# EasyEDA Pro project STM32F103ZET6__SS_.epro, board PCB1
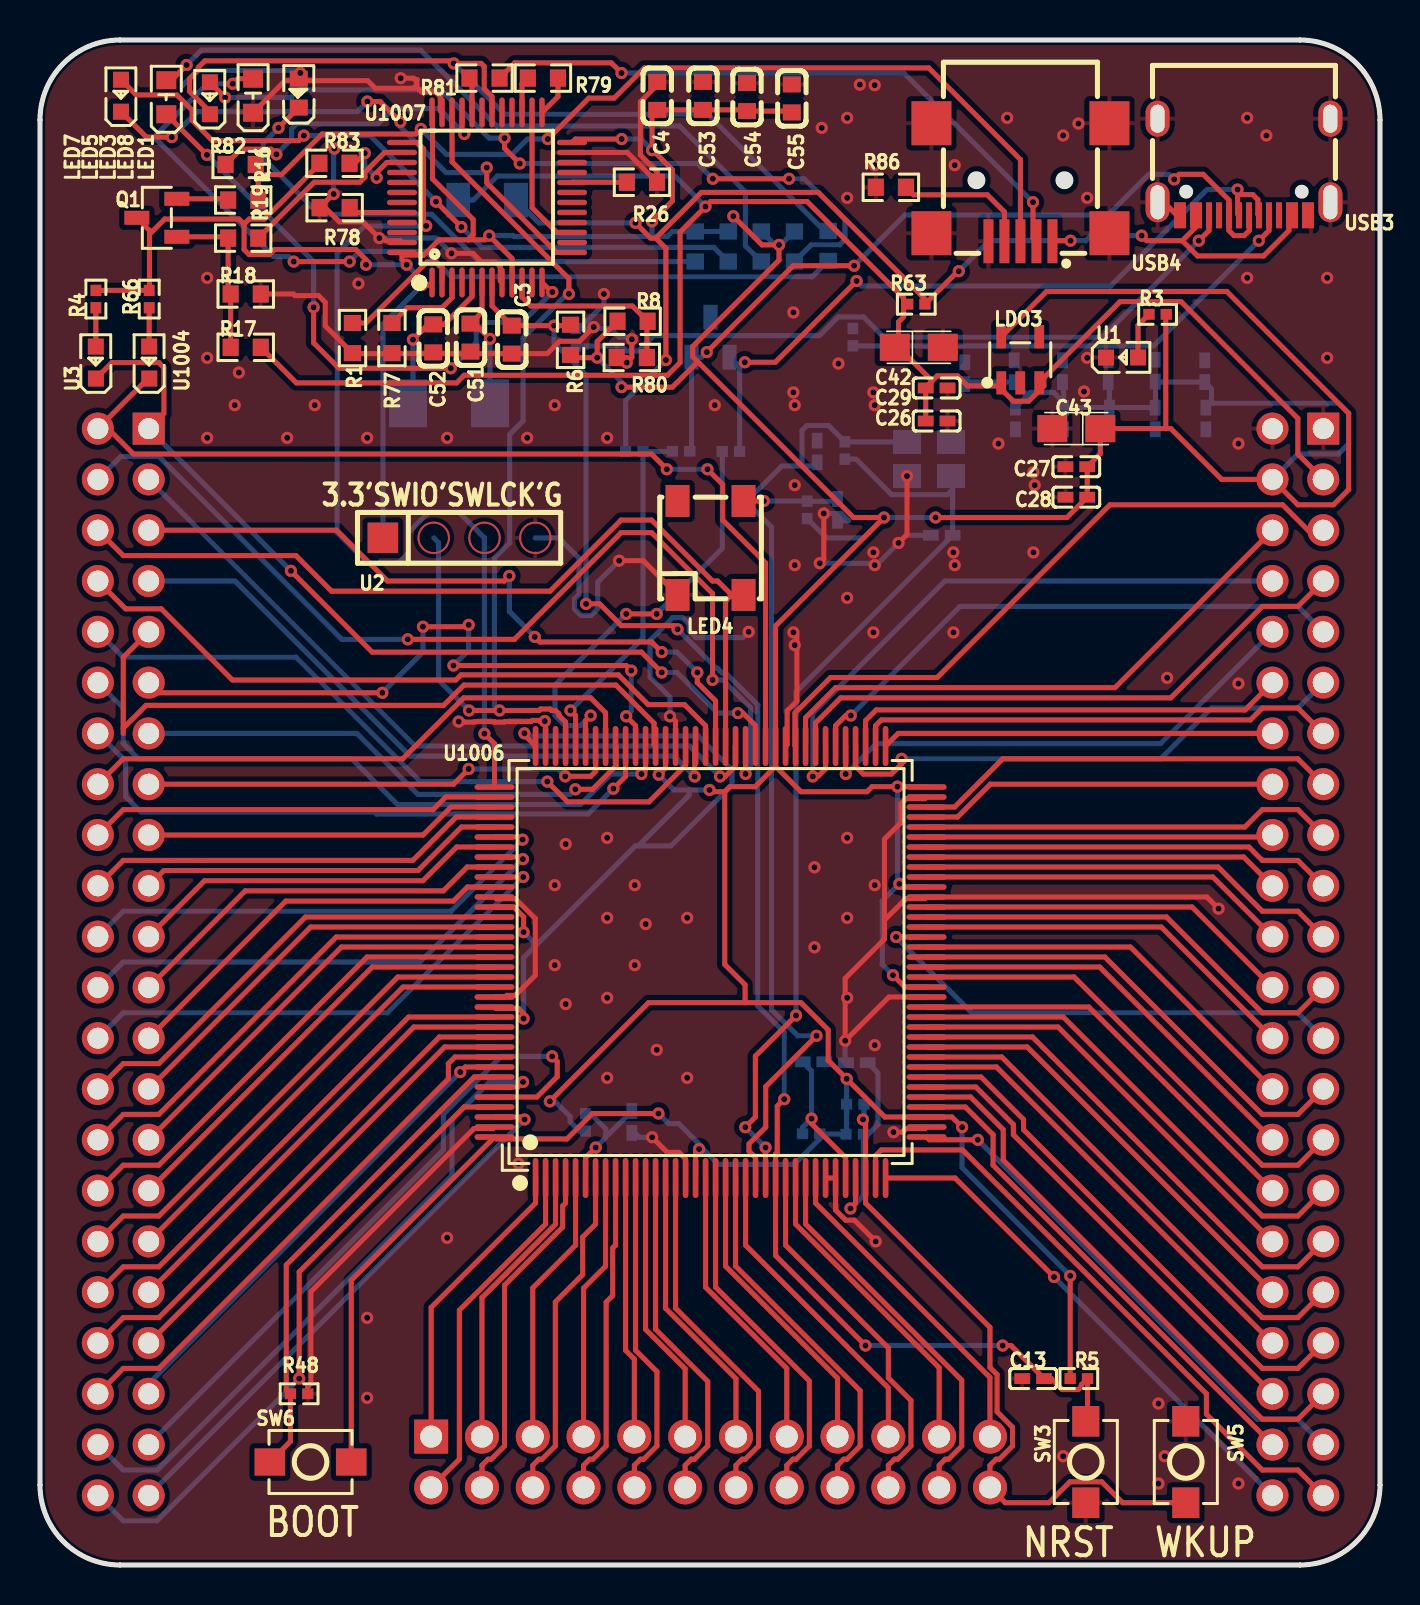
[diagram p1: board, top side]
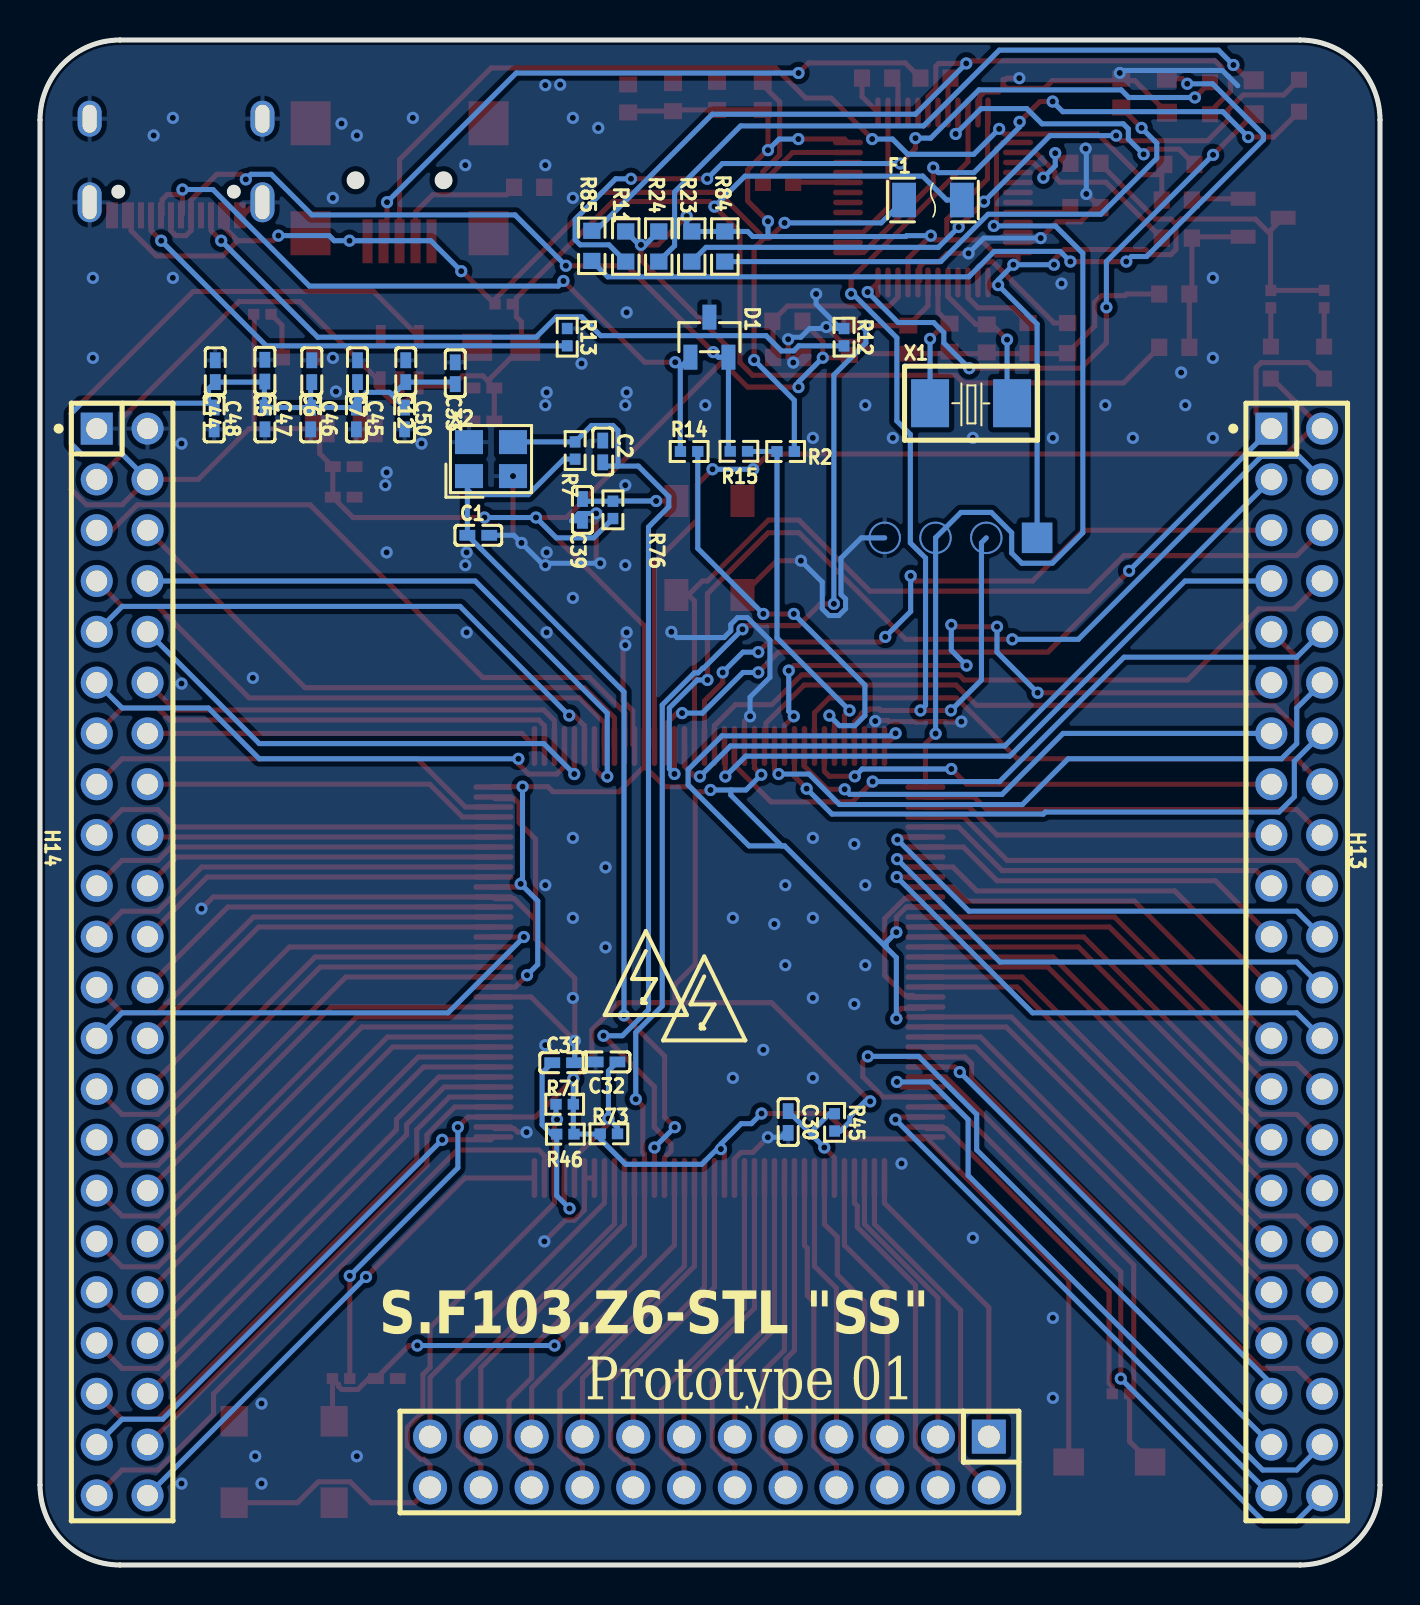
[diagram p2: board, bottom side, seen from below]

Outline 67 x 76.25 mm; copper layers: Top Layer, Bottom Layer. Coordinates in mm from the lower left corner of the outline.
Outline path: 0,72.25 0,4 arc(1.17,1.17) 4,0 63,0 arc(65.83,1.17) 67,4 67,72.25 arc(65.83,75.08) 63,76.25 4,76.25 arc(1.17,75.08) 0,72.25
Stack: Top Layer 0.035mm / Dielectric1 1.51mm FR4 er 4.5 / Bottom Layer 0.035mm

## Design rules (mm)
template: JLCPCB Capability(Two Layers Board)
spacing copperThickness1oz (default): track to track 0.102, other pairs 0.152 to 0.3
spacing copperThickness2oz: track to track 0.203, other pairs 0.152 to 0.3
track width copperThickness1oz (default): min 0.127, default 0.254, max 2.54
track width copperThickness2oz: min 0.203, default 0.254, max 2.54
differential pair differentialPair (default): width min 0.127, default 0.254, max 2.54; gap min 0.152, default 0.152
via viaSize (default): diameter min 0.5, default 0.61, max 10; hole min 0.3, default 0.305, max 6.3

## Placement (name value [footprint] x y rotation side)
C1  22pF  [C0402]  45.08 51.49 180 bottom
C2  22pF  [C0402]  38.86 55.68 270 bottom
C3  100nF  [C0603]  23.59 61.27 270 top
C4  100nF  [C0603]  30.86 73.46 90 top
C5  100nF  [C0402]  55.76 59.72 90 bottom
C6  100nF  [C0402]  53.41 59.69 90 bottom
C7  100nF  [C0402]  51.13 59.69 90 bottom
C12  100nF  [C0402]  48.71 59.69 90 bottom
C13  100nF  [C0402]  49.66 9.32 180 top
C26  100nF  [C0402]  44.83 57.2 0 top
C27  100nF  [C0402]  51.82 54.92 180 top
C28  100nF  [C0402]  51.82 53.39 180 top
C29  100nF  [C0402]  44.83 58.85 0 top
C30  100nF  [C0402]  29.59 22.15 270 bottom
C31  100nF  [C0402]  40.84 25.12 180 bottom
C32  100nF  [C0402]  38.67 25.15 0 bottom
C33  100nF  [C0402]  46.24 59.59 90 bottom
C39  100nF  [C0402]  39.88 52.76 270 bottom
C42  22uF  [CASE-A_3216]  43.94 60.88 0 top
C43  22uF  [CASE-A_3216]  51.82 56.82 180 top
C44  100nF  [C0402]  58.24 59.69 90 bottom
C45  100nF  [C0402]  51.18 57.33 270 bottom
C46  100nF  [C0402]  53.47 57.33 270 bottom
C47  100nF  [C0402]  55.75 57.33 270 bottom
C48  100nF  [C0402]  58.29 57.33 270 bottom
C50  100nF  [C0402]  48.77 57.33 270 bottom
C51  22pF  [C0603]  21.52 61.37 90 top
C52  22pF  [C0603]  19.66 61.33 90 top
C53  100nF  [C0603]  33.15 73.46 90 top
C54  100nF  [C0603]  35.35 73.4 90 top
C55  100nF  [C0603]  37.59 73.33 90 top
D1  ESD5302F-3/TR  [SOT-23-3_L2.9-W1.3-P1.90-LS2.4-BR]  33.53 61.39 270 bottom
F1  TLC-NSMD100  [F1206]  22.35 68.25 180 bottom
H12  PZ254V-12-24P  [HDR-TH_24P-P2.54-V-M-R2-C12-S2.54]  33.53 5.15 0 bottom
H13  X6521WV-2x22H-C60D30  [HDR-TH_44P-2.54-V-M-R2-C22-S2.54]  4.16 30.15 270 bottom
H14  X6521WV-2x22H-C60D30  [HDR-TH_44P-2.54-V-M-R2-C22-S2.54]  62.89 30.15 270 bottom
LDO3  ME6211C33M5G-N  [SOT-23-5_L3.0-W1.7-P0.95-LS2.8-BL]  49.01 60.26 0 top
LED1  19-217/BHC-ZL1M2RY/3T  [LED0603-FD_BLUE]  12.94 73.59 90 top
LED3  KT-0603R  [LED0603-RD]  8.5 73.34 90 top
LED4  WS2812E-V5  [LED-SMD_4P-L5.0-W5.0-LS5.4-TL-1]  33.53 50.85 270 top
LED5  NCD0603G1  [LED0603-RD_1]  6.31 73.39 90 top
LED7  KT-0603R  [LED0603-RD]  4.05 73.47 90 top
LED8  NCD0603G1  [LED0603-RD_1]  10.65 73.47 90 top
Q1  M8050  [SOT-23-3_L2.9-W1.3-P1.90-LS2.4-BR]  5.84 67.36 0 top
R1  10kΩ  [R0603]  15.62 61.35 90 top
R2  10kΩ  [R0402]  29.72 55.68 0 bottom
R3  10kΩ  [R0402]  55.88 62.54 0 top
R4  10kΩ  [R0402]  2.79 63.3 90 top
R5  10kΩ  [R0402]  51.94 9.32 180 top
R6  100kΩ  [R0603]  26.53 61.26 270 top
R7  10kΩ  [R0402]  40.24 55.73 90 bottom
R8  4.7kΩ  [R0603]  29.59 60.38 0 top
R11  1kΩ  [R0603]  37.71 65.93 270 bottom
R12  10kΩ  [R0402]  26.8 61.39 90 bottom
R13  10kΩ  [R0402]  40.64 61.39 90 bottom
R14  10kΩ  [R0402]  34.54 55.68 180 bottom
R15  10kΩ  [R0402]  32.05 55.68 180 bottom
R16  1.5kΩ  [R0603]  10.16 68.25 180 top
R17  10kΩ  [R0603]  10.29 60.88 0 top
R18  36kΩ  [R0603]  10.29 63.55 180 top
R19  100Ω  [R0603]  10.16 66.34 180 top
R23  1kΩ  [R0603]  34.41 65.93 270 bottom
R24  1kΩ  [R0603]  36.06 65.93 270 bottom
R26  10kΩ  [R0603]  30.1 69.14 180 top
R45  10kΩ  [R0402]  27.27 22.13 270 bottom
R46  10kΩ  [R0402]  40.73 21.54 0 bottom
R48  10kΩ  [R0402]  12.95 8.56 180 top
R63  10kΩ  [R0402]  43.82 63.04 0 top
R66  10kΩ  [R0402]  5.46 63.3 90 top
R71  10kΩ  [R0402]  40.77 23.04 180 bottom
R73  10kΩ  [R0402]  38.56 21.56 180 bottom
R76  10kΩ  [R0402]  38.35 52.76 90 bottom
R77  10kΩ  [R0603]  17.6 61.35 90 top
R78  10kΩ  [R0603]  14.73 67.87 180 top
R79  100Ω  [R0603]  25.15 74.35 0 top
R80  4.7kΩ  [R0603]  29.63 62.19 180 top
R81  10Ω  [R0603]  22.23 74.35 180 top
R82  10Ω  [R0603]  10.03 70.03 180 top
R83  4.7kΩ  [R0603]  14.72 70.09 0 top
R84  1kΩ  [R0603]  32.76 65.93 270 bottom
R85  1kΩ  [R0603]  39.41 65.96 270 bottom
R86  100kΩ  [R0603]  42.55 68.89 0 top
SW3  TS342A2P-WZ  [SW-SMD_L4.0-W2.9-LS5.0]  52.29 5.15 90 top
SW5  TS342A2P-WZ  [SW-SMD_L4.0-W2.9-LS5.0]  57.29 5.15 270 top
SW6  TS342A2P-WZ  [SW-SMD_L4.0-W2.9-LS5.0]  13.53 5.15 0 top
U1  -  [LED0603-RD_GREEN]  54.1 60.38 0 top
U2  -  [HDR4P]  15.88 50.09 0 top
U3  -  [LED0603-RD_GREEN]  2.79 60.12 90 top
U1004  -  [LED0603-RD_GREEN]  5.46 60.12 90 top
U1006  STM32F103ZET6  [LQFP-144_L20.0-W20.0-P0.50-LS22.0-BL]  33.53 30.15 0 top
U1007  STM32F103CBT6  [LQFP-48_L7.0-W7.0-P0.50-LS9.0-BL]  22.35 68.38 0 top
USB3  KH-TYPE-C-16P  [USB-C-SMD_KH-TYPE-C-16P]  60.2 69.9 180 top
USB4  MINI 5PTP  [MINI-USB-SMD_MINI-5PTP]  49.02 69.14 180 top
X1  8MHz  [OSC-SMD_L5.0-W3.2]  20.45 58.09 180 bottom
X2  8MHz  [CRYSTAL-SMD_4P-L3.2-W2.5-BL]  44.45 55.3 180 bottom

## Footprints (pads in the part's own frame, mm; a bottom-side part is the same pattern mirrored in y, then rotated)
C0402
  rect 0.79x0.54 smd: 1(-0.545,0) 2(0.545,0)
C0603
  rect 0.8x0.9 smd: 1(-0.7,0) 2(0.7,0)
CASE-A_3216
  rect 1.5x1.359 smd: 1(-1.2,0) 2(1.2,0)
CRYSTAL-SMD_4P-L3.2-W2.5-BL
  rect 1.4x1.2 smd: 1(-1.1,-0.85) 2(1.1,-0.85) 3(1.1,0.85) 4(-1.1,0.85)
F1206
  rect 1.19x1.728 smd: 1(-1.445,0) 2(1.445,0)
HDR4P
  custom 1.524x1.524 hole 0.914: 1(1.27,1.27) 2(3.81,1.27) 3(6.35,1.27) 4(8.89,1.27)
HDR-TH_24P-P2.54-V-M-R2-C12-S2.54
  rect 1.7x1.7 hole 1.1: 1(-13.97,-1.27)
  round 1.7 hole 1.1: 2(-13.97,1.27) 3(-11.43,-1.27) 4(-11.43,1.27) 5(-8.89,-1.27) 6(-8.89,1.27) 7(-6.35,-1.27) 8(-6.35,1.27) 9(-3.81,-1.27) 10(-3.81,1.27) 11(-1.27,-1.27) 12(-1.27,1.27) 13(1.27,-1.27) 14(1.27,1.27) 15(3.81,-1.27) 16(3.81,1.27) 17(6.35,-1.27) 18(6.35,1.27) 19(8.89,-1.27) 20(8.89,1.27) 21(11.43,-1.27) 22(11.43,1.27) 23(13.97,-1.27) 24(13.97,1.27)
HDR-TH_44P-2.54-V-M-R2-C22-S2.54
  rect 1.6x1.6 hole 1.05: 1(-26.67,-1.27)
  round 1.6 hole 1.05: 2(-26.67,1.27) 3(-24.13,-1.27) 4(-24.13,1.27) 5(-21.59,-1.27) 6(-21.59,1.27) 7(-19.05,-1.27) 8(-19.05,1.27) 9(-16.51,-1.27) 10(-16.51,1.27) 11(-13.97,-1.27) 12(-13.97,1.27) 13(-11.43,-1.27) 14(-11.43,1.27) 15(-8.89,-1.27) 16(-8.89,1.27) 17(-6.35,-1.27) 18(-6.35,1.27) 19(-3.81,-1.27) 20(-3.81,1.27) 21(-1.27,-1.27) 22(-1.27,1.27) 23(1.27,-1.27) 24(1.27,1.27) 25(3.81,-1.27) 26(3.81,1.27) 27(6.35,-1.27) 28(6.35,1.27) 29(8.89,-1.27) 30(8.89,1.27) 31(11.43,-1.27) 32(11.43,1.27) 33(13.97,-1.27) 34(13.97,1.27) 35(16.51,-1.27) 36(16.51,1.27) 37(19.05,-1.27) 38(19.05,1.27) 39(21.59,-1.27) 40(21.59,1.27) 41(24.13,-1.27) 42(24.13,1.27) 43(26.67,-1.27) 44(26.67,1.27)
LED0603-FD_BLUE
  rect 0.8x0.9 smd: 1(-0.72,0) 2(0.72,0)
LED0603-RD
  rect 0.8x0.8 smd: 1(-0.799,0) 2(0.799,0)
LED0603-RD_1
  rect 0.9x1 smd: 1(-0.85,0) 2(0.85,0)
LED0603-RD_GREEN
  rect 0.8x0.8 smd: 1(-0.8,-0.003) 2(0.8,0.003)
LED-SMD_4P-L5.0-W5.0-LS5.4-TL-1
  rect 1.6x1.2 smd: 1(-2.35,1.65) 2(-2.35,-1.65) 3(2.35,-1.65) 4(2.35,1.65)
LQFP-48_L7.0-W7.0-P0.50-LS9.0-BL
  oval 0.27x1.5 smd: 1(-2.75,-4.25) 2(-2.25,-4.25) 3(-1.75,-4.25) 4(-1.25,-4.25) 5(-0.75,-4.25) 6(-0.25,-4.25) 7(0.25,-4.25) 8(0.75,-4.25) 9(1.25,-4.25) 10(1.75,-4.25) 11(2.25,-4.25) 12(2.75,-4.25) 25(2.75,4.25) 26(2.25,4.25) 27(1.75,4.25) 28(1.25,4.25) 29(0.75,4.25) 30(0.25,4.25) 31(-0.25,4.25) 32(-0.75,4.25) 33(-1.25,4.25) 34(-1.75,4.25) 35(-2.25,4.25) 36(-2.75,4.25)
  oval 1.5x0.27 smd: 13(4.25,-2.75) 14(4.25,-2.25) 15(4.25,-1.75) 16(4.25,-1.25) 17(4.25,-0.75) 18(4.25,-0.25) 19(4.25,0.25) 20(4.25,0.75) 21(4.25,1.25) 22(4.25,1.75) 23(4.25,2.25) 24(4.25,2.75) 37(-4.25,2.75) 38(-4.25,2.25) 39(-4.25,1.75) 40(-4.25,1.25) 41(-4.25,0.75) 42(-4.25,0.25) 43(-4.25,-0.25) 44(-4.25,-0.75) 45(-4.25,-1.25) 46(-4.25,-1.75) 47(-4.25,-2.25) 48(-4.25,-2.75)
LQFP-144_L20.0-W20.0-P0.50-LS22.0-BL
  oval 0.28x2 smd: 1(-8.75,-10.8) 2(-8.25,-10.8) 3(-7.75,-10.8) 4(-7.25,-10.8) 5(-6.75,-10.8) 6(-6.25,-10.8) 7(-5.75,-10.8) 8(-5.25,-10.8) 9(-4.75,-10.8) 10(-4.25,-10.8) 11(-3.75,-10.8) 12(-3.25,-10.8) 13(-2.75,-10.8) 14(-2.25,-10.8) 15(-1.75,-10.8) 16(-1.25,-10.8) 17(-0.75,-10.8) 18(-0.25,-10.8) 19(0.25,-10.8) 20(0.75,-10.8) 21(1.25,-10.8) 22(1.75,-10.8) 23(2.25,-10.8) 24(2.75,-10.8) 25(3.25,-10.8) 26(3.75,-10.8) 27(4.25,-10.8) 28(4.75,-10.8) 29(5.25,-10.8) 30(5.75,-10.8) 31(6.25,-10.8) 32(6.75,-10.8) 33(7.25,-10.8) 34(7.75,-10.8) 35(8.25,-10.8) 36(8.75,-10.8) 73(8.75,10.8) 74(8.25,10.8) 75(7.75,10.8) 76(7.25,10.8) 77(6.75,10.8) 78(6.25,10.8) 79(5.75,10.8) 80(5.25,10.8) 81(4.75,10.8) 82(4.25,10.8) 83(3.75,10.8) 84(3.25,10.8) 85(2.75,10.8) 86(2.25,10.8) 87(1.75,10.8) 88(1.25,10.8) 89(0.75,10.8) 90(0.25,10.8) 91(-0.25,10.8) 92(-0.75,10.8) 93(-1.25,10.8) 94(-1.75,10.8) 95(-2.25,10.8) 96(-2.75,10.8) 97(-3.25,10.8) 98(-3.75,10.8) 99(-4.25,10.8) 100(-4.75,10.8) 101(-5.25,10.8) 102(-5.75,10.8) 103(-6.25,10.8) 104(-6.75,10.8) 105(-7.25,10.8) 106(-7.75,10.8) 107(-8.25,10.8) 108(-8.75,10.8)
  oval 2x0.28 smd: 37(10.8,-8.75) 38(10.8,-8.25) 39(10.8,-7.75) 40(10.8,-7.25) 41(10.8,-6.75) 42(10.8,-6.25) 43(10.8,-5.75) 44(10.8,-5.25) 45(10.8,-4.75) 46(10.8,-4.25) 47(10.8,-3.75) 48(10.8,-3.25) 49(10.8,-2.75) 50(10.8,-2.25) 51(10.8,-1.75) 52(10.8,-1.25) 53(10.8,-0.75) 54(10.8,-0.25) 55(10.8,0.25) 56(10.8,0.75) 57(10.8,1.25) 58(10.8,1.75) 59(10.8,2.25) 60(10.8,2.75) 61(10.8,3.25) 62(10.8,3.75) 63(10.8,4.25) 64(10.8,4.75) 65(10.8,5.25) 66(10.8,5.75) 67(10.8,6.25) 68(10.8,6.75) 69(10.8,7.25) 70(10.8,7.75) 71(10.8,8.25) 72(10.8,8.75) 109(-10.8,8.75) 110(-10.8,8.25) 111(-10.8,7.75) 112(-10.8,7.25) 113(-10.8,6.75) 114(-10.8,6.25) 115(-10.8,5.75) 116(-10.8,5.25) 117(-10.8,4.75) 118(-10.8,4.25) 119(-10.8,3.75) 120(-10.8,3.25) 121(-10.8,2.75) 122(-10.8,2.25) 123(-10.8,1.75) 124(-10.8,1.25) 125(-10.8,0.75) 126(-10.8,0.25) 127(-10.8,-0.25) 128(-10.8,-0.75) 129(-10.8,-1.25) 130(-10.8,-1.75) 131(-10.8,-2.25) 132(-10.8,-2.75) 133(-10.8,-3.25) 134(-10.8,-3.75) 135(-10.8,-4.25) 136(-10.8,-4.75) 137(-10.8,-5.25) 138(-10.8,-5.75) 139(-10.8,-6.25) 140(-10.8,-6.75) 141(-10.8,-7.25) 142(-10.8,-7.75) 143(-10.8,-8.25) 144(-10.8,-8.75)
MINI-USB-SMD_MINI-5PTP
  rect 0.5x2.2 smd: 1(-1.6,2.95) 2(-0.8,2.95) 3(0,2.95) 4(0.8,2.95) 5(1.6,2.95)
  rect 2x2.2 smd: 6(-4.45,2.55) 7(4.45,2.55) 8(4.45,-2.95) 9(-4.45,-2.95)
OSC-SMD_L5.0-W3.2
  rect 1.9x2.4 smd: 1(-2.05,0) 2(2.05,0)
R0402
  rect 0.566x0.54 smd: 1(-0.433,0) 2(0.433,0)
R0603
  rect 0.806x0.864 smd: 1(-0.753,0) 2(0.753,0)
SOT-23-3_L2.9-W1.3-P1.90-LS2.4-BR
  rect 1.25x0.7 smd: 1(1,-0.95) 2(1,0.95) 3(-1,0)
SOT-23-5_L3.0-W1.7-P0.95-LS2.8-BL
  rect 0.49x1.157 smd: 1(-0.95,-1.153) 2(0,-1.153) 3(0.95,-1.153)
  rect 0.49x1.175 smd: 4(0.95,1.153) 5(-0.95,1.153)
SW-SMD_L4.0-W2.9-LS5.0
  rect 1.53x1.36 smd: 1(-2.035,0) 2(2.035,0)
USB-C-SMD_KH-TYPE-C-16P
  oval 1.2x2 hole 0.7x1.7: 1(-4.32,1.765) 2(4.32,1.765)
  oval 1.2x1.8 hole 0.7x1.4: 3(-4.32,-2.415) 4(4.32,-2.415)
  rect 0.3x1.3 smd: A1(-3.35,2.415) A4(-2.55,2.415) A5(-1.25,2.415) A6(-0.25,2.415) A7(0.25,2.415) A8(1.25,2.415) A9(2.55,2.415) A12(3.35,2.415) B1(3.05,2.415) B4(2.25,2.415) B5(1.75,2.415) B6(0.75,2.415) B7(-0.75,2.415) B8(-1.75,2.415) B9(-2.25,2.415) B12(-3.05,2.415)

## Nets
As in the schematic.

Pads without a net: LDO3 4; LED4 2; U1006 106; U1007 4 11 14 16 17 19 21 22 28 29 40 41 42 43 45 46; USB3 A8 B8

## Via types
v1: diameter 0.61, hole 0.305, Top Layer to Bottom Layer, 248 vias

## Routing (per net, layer and track width the routed paths; a pad name or vN(x,y) marks a point on that pad's centre or on a via; arc(x,y) is an arc through that point)
+3.3V: length 401.7
  Top Layer w0.254: 35.25,28.12 35.25,29.01 34.24,30.03 34.24,38.66 ; 35.25,28.12 30.43,28.12 v1(25.49,23.18) ; 35.25,28.12 38.05,28.12 39.41,26.76 39.41,25.23 v1(40.33,24.31) 42.24,22.4 U1006.39 45.6,22.4 v1(46.11,21.89) ; LDO3.5 50.33,63.68 59.34,63.68 65.43,57.58 65.43,53.77 64.67,53.01 62.89,53.01 H14.4 59.08,54.28 56.54,56.82 56.29,56.82 ; Q1.3 5.47,66.73 5.47,66.54 ; 56.29,56.82 C43.1 53.02,55.57 C27.1 C28.1 51.35,52.38 v1(44.78,52.38) ; 56.29,56.82 56.29,62.51 R3.2 ; 34.24,38.66 34.49,38.92 35.76,38.92 36.78,39.93 ; 34.24,38.66 33.56,38.66 v1(33.48,38.75) ; v1(34.67,67.44) 36.1,66.01 v1(36.95,66.01) 36.95,65.24 32.63,60.93 32.63,60.42 32.89,60.16 ; U1007.9 23.6,65.32 v1(22.46,66.47) 22.25,66.26 21.4,66.26 ; v1(29.08,58.89) 31.62,58.89 32.89,60.16 ; 5.47,66.54 5.47,63.74 R66.2 R4.2 ; 5.47,66.54 6.24,67.3 9.95,67.3 10.2,67.05 ; v1(16.3,65.01) 16.3,65.27 15.79,65.78 11.73,65.78 11.47,65.52 10.46,65.52 10.2,65.78 10.2,67.05 ; 18.1,65.5 U1007.48 ; 18.1,65.5 19.19,65.5 19.95,66.26 21.4,66.26 ; 18.1,65.5 18.1,65.24 v1(18.33,65.01) ; U1007.24 26.77,71.3 v1(29.08,71.3) ; R80.2 27.86,61.17 v1(27.86,60.37) 26.67,60.37 R6.2 ; v1(30.6,67.19) 31.62,68.2 31.62,69.76 30.64,70.74 v1(30.6,70.74) 30.6,72.5 C4.1 C53.1 35.29,72.76 C54.1 37.53,72.7 C55.1 ; 21.4,66.26 21.66,66.51 21.66,67.28 19.63,69.31 19.63,72.6 U1007.36 ; U1006.52 43.24,28.9 v1(42.65,29.49) ; 32.89,60.16 40.68,52.38 v1(42.2,52.38) 36.78,46.95 U1006.84 36.78,39.93 ; R83.1 13.97,70.05 11.22,67.3 10.46,67.3 10.2,67.05 ; U1006.121 23.68,32.9 24.18,32.4 v1(24.18,31.64) ; U1006.62 43.12,33.9 v1(42.97,34.06) ; 36.78,39.93 38.05,38.66 41.35,38.66 41.6,38.92 v1(42.87,38.92) 44.31,38.92 U1006.72 ; U1006.108 24.22,41.51 v1(24.22,41.59) ; v1(51.51,14.46) R5.2 ; U1007.1 19.47,64 v1(19.09,64) ; U1006.131 22.8,27.83 23.93,27.83 24.18,27.58 v1(24.18,27.32) ; v1(32.95,20.8) 32.78,20.62 U1006.17 ; SW6.2 15.56,14.23 U1006.144 22.82,21.31 26.35,21.31 27.62,22.58 v1(30.92,22.58) ; v1(30.94,39.51) 31.28,39.86 U1006.95
  Bottom Layer w0.254: 58.58,58.09 58.51,58.09 C48.1 ; 58.58,58.09 64.92,58.09 65.43,57.58 65.43,56.06 64.92,55.55 62.89,55.55 H14.4 ; 58.58,58.09 58.58,58.81 C44.1 55.78,59.15 ; v1(44.78,52.38) v1(42.2,52.38) 41.19,51.36 39.32,51.36 R76.1 ; 17.14,51.36 17.14,62.05 v1(19.09,64) 19.09,64.25 v1(18.33,65.01) v1(16.3,65.01) ; 30.6,66.42 23.71,66.42 23.67,66.47 v1(22.46,66.47) ; 30.6,66.42 31.36,66.42 31.62,66.68 R84.1 R23.1 34.67,66.93 v1(34.67,67.44) ; 30.6,66.42 v1(30.6,67.19) ; v1(42.65,29.49) 42.11,30.03 42.11,33.2 v1(42.97,34.06) ; v1(30.94,39.51) 31.7,38.75 32.46,38.75 ; 27.27,21.7 26.98,21.7 26.51,22.17 26.51,22.42 25.75,23.18 v1(25.49,23.18) ; C46.1 C45.1 51.18,58.13 ; C46.1 53.47,59.09 C6.1 ; C46.1 C47.1 55.78,57.9 55.78,59.15 ; C7.1 51.18,59.09 51.18,58.13 ; 32.46,38.75 32.46,38.5 29.92,35.96 ; 32.46,38.75 v1(33.48,38.75) ; 55.78,59.15 C5.1 ; v1(46.11,21.89) 46.11,19.86 v1(51.51,14.46) ; v1(29.08,71.3) 30.05,71.3 v1(30.6,70.74) ; v1(24.18,31.64) 24.69,31.13 24.69,30.88 ; R11.1 37.04,66.01 v1(36.95,66.01) 36.73,66.01 R24.1 ; 29.92,35.96 31.55,35.96 34.6,39.01 34.6,39.77 32.91,41.46 24.35,41.46 v1(24.22,41.59) ; 29.92,35.96 29.77,35.96 24.69,30.88 ; 24.69,30.88 24.18,30.37 v1(24.18,27.32) ; 49.28,58.38 49.53,58.64 50.67,58.64 51.18,58.13 ; 49.28,58.38 C50.1 ; 49.28,58.38 49.28,58.58 C12.1 46.34,59.15 C33.1 ; v1(40.33,24.31) R71.2 40.33,21.58 R46.1 39.01,21.54 38.99,21.56 38.99,21.31 37.72,20.04 33.91,20.04 33.15,20.8 v1(32.95,20.8) 32.95,21.05 31.94,22.07 31.43,22.07 v1(30.92,22.58) ; v1(27.86,60.37) 29.08,59.15 v1(29.08,58.89) ; v1(42.87,38.92) 42.87,34.35 43.13,34.09
+5V: length 91.4
  Top Layer w0.254: 44.61,59.21 42.93,60.88 ; 44.61,59.21 44.29,58.89 C29.1 C26.1 ; 44.61,59.21 44.86,59.46 45.88,59.46 46.38,58.95 48.16,58.95 ; 42.93,60.88 42.93,62.15 43.18,62.41 43.18,62.84 ; 42.93,60.88 C42.1 ; R17.2 12.82,59.11 20.83,59.11 21.21,59.49 31.37,59.49 32,60.12 32,66.65 v1(33.27,67.92) 33.53,68.18 38.35,68.18 43.18,63.35 43.18,62.84 ; 50.19,59.36 49.96,59.11 ; 50.19,59.36 50.19,58.95 49.43,58.19 48.67,58.19 48.16,58.7 48.16,58.95 ; 50.19,59.36 54,63.17 57.05,63.17 62.89,57.33 62.89,55.55 H14.3 ; 43.18,62.84 R63.1 ; 48.16,58.95 48.06,59.11
  Bottom Layer w0.254: v1(33.27,67.92) 31.75,69.45 22.86,69.45 21.67,68.25 F1.2
GND: length 197.3
  Top Layer w0.254: v1(58.93,32.82) 58.35,33.4 U1006.61 44.25,33.32 43.29,33.32 42.22,32.25 ; U1006.51 42.45,28.4 v1(40.26,26.21) 40.26,29.33 42.22,31.3 42.22,32.25 ; 13.39,8.56 13.39,8.92 13.54,9.08 13.54,13.67 21.69,21.82 22.65,21.82 U1006.143 ; R18.1 12.67,63.55 12.75,63.47 13.92,63.47 14.26,63.13 14.26,61.95 R1.1 15.65,60.57 C3.2 25.36,60.57 25.98,61.19 26.97,61.19 v1(27.69,61.9) ; 29.46,60.25 29.34,60.38 R8.1 ; 29.46,60.25 29.59,60.38 v1(29.59,61.29) ; 29.46,60.25 v1(29.34,60.12) ; v1(42.93,51.11) 43.35,51.53 v1(43.35,54.45) ; v1(18.03,74.34) 18.67,74.34 18.79,74.22 18.85,74.27 18.85,74.02 18.67,73.84 ; LED4.3 30.16,50.22 v1(28.96,50.22) ; v1(30.61,21.39) 31.36,20.63 31.95,20.63 32.28,20.3 U1006.16 ; C4.2 30.85,74.15 30.85,73.99 30.02,73.16 30.02,70.5 30.85,69.67 R26.1 29.36,70.63 U1007.23 ; 18.67,73.84 16.76,73.84 16.38,74.22 12.26,74.22 LED8.1 ; 18.67,73.84 18.89,73.84 19.07,73.66 19.77,73.66 20.02,73.41 20.02,72.71 U1007.35 ; USB3.A12 56.2,68.14 USB3.2 ; 42.22,32.25 42.22,36.3 43.05,37.12 43.05,38.07 43.29,38.32 44.25,38.32 U1006.71 ; v1(20.57,65.58) 21.65,65.58 22.07,65.16 22.77,65.16 23.02,64.91 23.02,64.21 U1007.8 ; v1(42.67,21.64) 43.12,21.64 43.29,21.82 44.25,21.82 U1006.38 ; U1006.120 22.81,33.32 23.77,33.32 24.77,32.32 24.77,29.48 23.76,28.48 23.35,28.48 23.27,28.4 U1006.130 ; v1(39.19,52.58) 39.19,50.29 v1(38.99,50.09) ; U1006.107 25.28,42.16 v1(25.24,42.2) 25.21,42.17 25.01,42.17 24.95,42.23 24.6,42.23 24.55,42.17 23.24,42.17 23.22,42.14 22.73,42.14 22.71,42.17 21.72,42.17 21.69,42.14 21.21,42.14 21.18,42.17 v1(20.93,42.17) ; U1006.30 U1006.31 39.78,17.75 40.28,17.24 40.72,17.24 v1(41.78,16.18) ; U1007.47 18.02,66.21 17.32,66.21 17.18,66.35 v1(16.97,66.35) 16.15,67.16 14.97,67.16 14.26,67.87 R78.2 14.61,68.5 14.73,68.5 ; 37.85,46.53 37.85,43.2 37.36,42.71 37.36,41.03 U1006.83 ; 31.5,42.47 31.78,42.19 U1006.94
  Bottom Layer w0.254: v1(14.69,68.55) 14.69,70.79 ; v1(38.99,50.09) 41.91,50.09 v1(42.93,51.11) 43.31,51.49 C1.2 ; v1(20.57,65.58) 19.81,66.35 v1(16.97,66.35) ; R12.2 26.98,61.83 ; 26.98,61.83 28.52,61.83 28.96,61.39 29.59,61.39 ; 26.98,61.83 28.19,63.04 v1(28.19,63.55) ; v1(40.26,26.21) 40.26,25.15 40.3,25.12 ; C30.2 29.76,21.6 29.97,21.39 v1(30.61,21.39) ; 12.83,74.73 7.88,74.73 7.57,74.42 7.56,74.42 7.11,73.97 ; v1(31.5,42.44) 31.5,43.39 30.5,44.39 30.5,46.24 31.64,47.37 32.12,47.37 32.46,47.03 32.46,46.71 32.8,46.37 35.14,46.37 v1(35.43,46.66) ; v1(28.96,50.22) 27.89,49.15 27.89,47.82 27.55,47.47 27.06,47.47 26.72,47.82 26.72,48.3 26.95,48.53 26.95,50.34 25.93,51.36 24.77,51.36 ; v1(39.19,52.58) 40.06,52.58 40.42,52.21 C39.2
  vias: v1(8.36,64.36) v1(8.36,60.36) v1(8.36,56.36) v1(9.73,57.99) v1(9.94,59.62) v1(12.36,56.36) v1(13.01,74.6) v1(13.73,57.99) v1(14.72,70.82) v1(15.92,64.07) v1(16.36,56.36) v1(16.36,12.36) v1(16.36,8.36) v1(20.36,56.36) v1(20.36,16.36) v1(23.92,20.07) v1(24.36,56.36) v1(25.73,57.99) v1(25.73,33.99) v1(25.73,29.99) v1(26.28,36.05) v1(26.28,28.05) v1(28.36,56.36) v1(28.36,36.36) v1(28.36,32.36) v1(28.36,28.36) v1(28.36,24.36) v1(29.73,33.99) v1(29.73,29.99) v1(30.28,32.05) v1(30.84,25.76) v1(32.36,32.36) v1(32.36,24.36) v1(33.73,57.99) v1(37.67,62.63) v1(37.67,58.63) v1(37.67,46.63) v1(37.73,57.99) v1(37.73,53.99) v1(37.73,49.99) v1(37.73,45.99) v1(38.72,34.89) v1(38.72,30.89) v1(39.09,71.86) v1(39.92,60.07) v1(40.36,72.36) v1(40.36,68.36) v1(40.36,48.36) v1(40.36,36.36) v1(40.36,32.36) v1(40.36,28.36) v1(40.99,74.02) v1(41.67,58.63) v1(41.67,50.63) v1(41.67,46.63) v1(41.73,73.99) v1(41.73,69.99) v1(41.73,57.99) v1(41.73,49.99) v1(41.73,33.99) v1(41.73,25.99) v1(45.67,50.63) v1(45.67,46.63) v1(45.73,69.99) v1(45.73,49.99) v1(47.92,56.07) v1(48.36,72.36) v1(49.67,54.63) v1(49.67,50.63) v1(49.73,53.99) v1(51.16,71.48) v1(51.16,5.44) v1(51.92,72.07) v1(52.2,58.67) v1(52.36,68.36) v1(52.36,60.36) v1(55.92,8.07) v1(55.92,4.07) v1(56.24,5.44) v1(56.36,44.36) v1(59.92,56.07) v1(59.92,44.07) v1(59.92,4.07) v1(60.36,72.36) v1(60.36,64.36) v1(61.32,71.48) v1(64.36,64.36) v1(64.36,60.36)
VBAT: length 6
  Top Layer w0.254: U1006.6 27.28,20.37 v1(27.79,20.87)
  Bottom Layer w0.254: 28.29,21.54 28.29,21.8 27.53,22.56 27.28,22.56 R45.1 ; 28.29,21.54 28.44,21.54 C30.1 ; 28.29,21.54 28.29,21.38 v1(27.79,20.87)
VBUS: length 60.8
  Top Layer w0.254: 57.88,67.41 USB3.B4 ; 57.88,67.41 57.72,67.41 USB3.A9 ; 57.88,67.41 57.88,66.98 57.11,66.22 ; 30.79,66.34 33.07,68.63 38.91,68.63 44.25,63.3 R63.2 45.9,64.69 v1(45.94,64.69) ; 30.79,66.34 31.29,65.84 v1(31.29,60.25) ; 30.79,66.34 30.53,66.34 v1(29.77,67.11) ; v1(55.08,66.47) 55.34,66.22 57.11,66.22 ; v1(51.53,66.22) 50.65,66.22 USB4.1 ; USB3.A4 USB3.B9 62.45,66.72 61.18,65.45 57.88,65.45 57.11,66.22
  Bottom Layer w0.254: F1.1 24.94,67.11 v1(29.77,67.11) ; v1(31.29,60.25) 29.29,58.24 R2.1 ; v1(45.94,64.69) 47.46,66.22 v1(51.53,66.22) 52.29,66.22 52.54,66.47 v1(55.08,66.47)
VDDA: length 9.8
  Top Layer w0.254: U1006.33 40.78,18.08 v1(40.52,17.83)
  Bottom Layer w0.254: C31.1 41.9,24.61 41.9,22.02 41.42,21.54 R46.2 41.17,18.47 v1(40.52,17.83)
AIN: length 9.3
  Top Layer w0.254: U1007.10 24.1,63.39 24.54,62.95 29.62,62.95 R80.1 30.34,62.15 R8.2
BOOT0: length 24.7
  Top Layer w0.254: U1006.138 21.71,24.4 12.31,15 12.31,8.77 R48.2 12.52,6.18 SW6.1
CC1: length 24
  Top Layer w0.254: v1(60.94,66.22) 61.45,66.72 USB3.A5
  Bottom Layer w0.254: v1(60.94,66.22) 55.68,60.96 R13.1
CC2: length 35.9
  Top Layer w0.254: USB3.B5 58.45,66.72 v1(57.94,66.22)
  Bottom Layer w0.254: R12.1 29.06,60.96 29.32,60.71 29.93,60.71 30.69,61.47 38.97,61.47 39.91,62.41 41.18,62.41 42.19,61.39 53.11,61.39 v1(57.94,66.22)
D+: length 49.2
  Top Layer w0.254: 10.91,69.52 12.08,69.52 14.11,71.55 18.79,71.55 v1(19.04,71.81) ; 10.91,69.52 10.91,69.9 R82.1 ; 10.91,69.52 R16.1 ; v1(25.39,71.3) 27.44,73.35 28.71,73.35 30.22,74.85 44.44,74.85 49.02,70.27 USB4.3
  Bottom Layer w0.254: v1(19.04,71.81) 20.31,70.54 23.61,70.54 24.38,71.3 v1(25.39,71.3)
D-: length 31.9
  Top Layer w0.254: v1(49.65,68.14) 49.65,66.36 USB4.2 ; v1(29.07,74.6) 28.57,75.11 23.74,75.11 R81.1
  Bottom Layer w0.254: v1(29.07,74.6) 43.19,74.6 v1(49.65,68.14)
DN: length 37
  Top Layer w0.254: 59.88,68.52 59.88,67.56 USB3.A7 ; 59.88,68.52 v1(59.88,68.77) ; 59.88,68.52 60.64,68.52 60.89,68.27 60.89,67.54 USB3.B7 ; v1(40.83,64.2) 36.76,60.14 v1(35.24,60.14)
  Bottom Layer w0.254: v1(59.88,68.77) 58.35,68.77 53.53,63.95 41.08,63.95 v1(40.83,64.2) ; 34.99,59.88 v1(35.24,60.14) ; 34.99,59.88 D1.1 ; 34.99,59.88 34.99,55.69 R14.1
DP: length 39.7
  Top Layer w0.254: v1(33.34,60.65) 37.66,64.96 v1(40.71,64.96) ; USB3.A6 60.46,67.47 60.46,66.72 60.21,66.47 59.7,66.47 59.45,66.72 USB3.B6 59.45,68.25 58.16,69.54 56.96,69.54 v1(56.71,69.28)
  Bottom Layer w0.254: v1(33.34,60.65) 33.09,60.39 D1.2 32.58,55.78 R15.1 ; v1(56.71,69.28) 56.45,69.54 55.44,69.54 53.41,67.5 43.25,67.5 v1(40.71,64.96)
LED_STLINK: length 42.1
  Top Layer w0.254: LED3.1 8.5,72.67 7.48,73.68 7.48,74.32 7.91,74.76 7.91,74.88 8.24,75.21 20.56,75.21 v1(20.69,75.08) 22.06,75.08 22.21,74.93 22.21,73.81 22.6,73.42 U1007.30
  Bottom Layer w0.254: R85.1 39.21,66.71 33.39,72.54 23.23,72.54 v1(20.69,75.08)
NRST: length 79.7
  Top Layer w0.254: v1(31.88,46.79) 31.69,46.97 29.07,46.97 27.98,48.06 v1(27.3,48.06) ; SW3.2 52.38,7.27 R5.1 52.07,9.02 52.07,8.94 51.91,8.77 51.11,8.77 50.56,9.32 C13.1 48.55,10.97 v1(48.13,10.97) ; v1(41.28,10.97) 36.78,15.47 U1006.25 36.78,20.55 36.86,20.63 36.86,22.94 v1(37.21,23.29) ; U1007.7 22.6,62.96 C3.1 v1(25.71,61.97) 26.49,61.97 R6.1
  Bottom Layer w0.254: v1(48.13,10.97) v1(41.28,10.97) ; v1(27.3,48.06) 27.3,59.5 25.71,61.1 v1(25.71,61.97) ; 32,46.66 33.83,44.84 33.87,44.84 34.1,44.61 34.28,44.61 35.89,43 35.89,27.95 37.21,26.63 v1(37.21,23.29)
OS_IN: length 7.8
  Top Layer w0.254: U1007.5 21.6,63.42 20.21,62.03 C52.2 19.41,62.03 v1(18.65,61.27)
  Bottom Layer w0.254: X1.2 18.65,58.34 v1(18.65,61.27)
OS_OUT: length 6.8
  Top Layer w0.254: U1007.6 22.1,62.65 C51.2 21.73,62.07 v1(22.5,61.31)
  Bottom Layer w0.254: v1(22.5,61.31) 22.5,58.09
OSC_IN: length 49
  Top Layer w0.254: v1(38.83,26.46) 36.29,23.92 36.29,21.89 35.45,21.05 35.45,20.69 35.78,20.37 U1006.23
  Bottom Layer w0.254: C2.2 38.68,54.95 38.1,54.95 ; v1(38.83,26.46) 37.88,26.46 36.58,27.77 36.58,51.9 35.56,52.91 35.56,53.42 37.08,54.95 38.1,54.95 ; 38.1,54.95 38.1,56.72 38.35,56.98 39.42,56.98 R7.2 43.34,56.16 X2.3
OSC_OUT: length 46.1
  Top Layer w0.254: v1(35.26,21.89) 35.77,22.4 35.77,25.45 v1(37.8,27.48) ; U1006.24 v1(36.28,20.87)
  Bottom Layer w0.254: 45.63,53.77 45.38,53.52 42.58,53.52 40.81,55.29 R7.1 ; 45.63,53.77 C1.1 37.8,43.66 v1(37.8,27.48) ; 45.63,53.77 45.63,54.37 X2.1 ; v1(36.28,20.87) v1(35.26,21.89)
PA0-WKUP: length 33.8
  Top Layer w0.254: SW5.2 54.13,3.12 53.09,4.16 51.49,4.16 50.45,3.12 48.26,3.12 H12.24 47.5,4.98 47.8,5.29 47.97,5.29 48.63,5.95 48.63,6.89 47.85,7.66 47.85,9.52 47.5,9.88 47.5,11.88 41.28,18.1 U1006.34 41.28,22.15 v1(41.15,22.28)
  Bottom Layer w0.254: v1(41.15,22.28) 41.2,22.33 R71.1
PA1: length 31.4
  Top Layer w0.254: U1006.35 41.78,20.47 42.07,20.75 46.13,20.75 58.32,8.56 58.32,7.54 61.11,4.75 62.89,4.75 H14.43
PA2: length 25.9
  Top Layer w0.254: U1006.36 45.75,19.35 v1(50.7,14.4)
  Bottom Layer w0.254: H14.44 v1(50.7,14.4)
PA3: length 26.2
  Top Layer w0.254: U1006.37 44.47,21.26 v1(46.89,21.26)
  Bottom Layer w0.254: v1(46.89,21.26) 60.86,7.29 62.89,7.29 H14.41
PA4: length 25.2
  Top Layer w0.254: U1006.40 46.27,22.9 47.65,21.51 47.65,19.99 H14.42
PA5: length 27.9
  Top Layer w0.254: H14.39 62.89,7.29 61.11,7.29 48.16,20.24 48.16,21.77 46.53,23.4 U1006.41
PA6: length 23.9
  Top Layer w0.254: U1006.42 46.79,23.9 48.67,22.02 48.67,21.51 H14.40
PA7: length 26.7
  Top Layer w0.254: U1006.43 47.05,24.4 49.18,22.28 49.18,21.77 61.11,9.83 62.89,9.83 H14.37
PA8: length 26.2
  Top Layer w0.254: v1(26.77,38.79) 27.63,38.79 28.8,39.96 28.8,40.93 U1006.100
  Bottom Layer w0.254: v1(26.77,38.79) 26.52,38.53 18.89,38.53 15.85,41.58 H13.13
PA9: length 29.1
  Top Layer w0.254: 2.89,39.04 4.16,40.31 18.13,40.31 21.18,43.36 27.53,43.36 28.28,42.61 U1006.101
PA10: length 24.2
  Top Layer w0.254: H13.15 20.67,39.04 v1(21.44,39.8) ; U1006.102 27.79,39.69 27.53,39.43 v1(26.26,39.43)
  Bottom Layer w0.254: v1(26.26,39.43) 25.89,39.8 v1(21.44,39.8)
PA11/USB_DM: length 21.4
  Top Layer w0.254: v1(29.31,47.55) v1(30.83,47.55) ; U1006.103 27.28,42.22 v1(27.53,42.47)
  Bottom Layer w0.254: v1(30.83,47.55) 34.11,50.83 R14.2 ; v1(27.53,42.47) 27.02,41.97 26.26,41.97 25.75,42.47 25.75,44 v1(29.31,47.55)
PA12/USB_DP: length 17.8
  Top Layer w0.254: v1(26.52,42.73) 26.78,42.47 U1006.104
  Bottom Layer w0.254: R15.2 31.61,55.68 R2.2 30.15,46.36 v1(26.52,42.73)
PA13-SWIO: length 49.7
  Top Layer w0.254: U1007.34 20.6,70.16 26.44,64.32 v1(26.44,63.56) ; v1(21.45,42.73) v1(22.98,42.73) 24.96,42.73 25.03,42.8 25.52,42.8 25.59,42.73 25.78,42.73 25.94,42.56 25.94,42.49 26.28,42.15 U1006.105
  Bottom Layer w0.254: U2.2 19.93,51.11 19.93,44.25 v1(21.45,42.73) ; v1(26.44,63.56) 26.35,63.56 24.16,61.36 24.16,57.21 23.48,56.53 23.48,51.11 22.72,50.35 22.72,42.98 v1(22.98,42.73)
PA14-SWCK: length 46.9
  Top Layer w0.254: v1(19.31,66.96) 19.18,67.09 19.18,70.81 18.86,71.13 U1007.37 ; U1006.109 22.73,41.06 v1(22.22,41.57)
  Bottom Layer w0.254: v1(19.31,66.96) 16.23,66.96 14.86,65.58 14.86,51.61 16.38,50.09 17.91,50.09 18.42,50.6 18.42,51.61 19.43,52.63 20.95,52.63 22.22,51.36 v1(22.22,41.57)
PA15: length 20.6
  Top Layer w0.254: U1006.110 20.29,38.4 19.66,37.77 4.16,37.77 2.89,36.5
PB0: length 22.4
  Top Layer w0.254: U1006.46 49.36,25.9 H14.36
PB1: length 25.1
  Top Layer w0.254: U1006.47 49.63,26.4 61.11,14.91 62.89,14.91 H14.33
PB2: length 21.7
  Top Layer w0.254: H14.34 50.9,26.9 U1006.48
PB3: length 22.8
  Top Layer w0.254: U1006.133 18.69,26.9 H13.35
PB4: length 26.2
  Top Layer w0.254: 2.89,11.1 4.16,12.37 5.94,12.37 19.97,26.4 U1006.134
PB5: length 23.4
  Top Layer w0.254: U1006.135 20.23,25.9 H13.37
PB6: length 27.3
  Top Layer w0.254: 2.89,8.56 4.16,9.83 5.94,9.83 20.42,24.31 20.42,25.07 20.75,25.4 U1006.136
PB7: length 24.4
  Top Layer w0.254: v1(21.01,24.65) 21.27,24.9 U1006.137
  Bottom Layer w0.254: H13.39 5.43,9.07 v1(21.01,24.65)
PB8: length 33
  Top Layer w0.254: U1006.139 23.9,23.9 v1(24.15,24.15)
  Bottom Layer w0.254: v1(24.15,24.15) 22.47,24.15 20.6,22.28 20.6,19.48 5.86,4.75 4.16,4.75 2.89,6.02
PB9: length 33.9
  Top Layer w0.254: U1006.140 24.85,23.4 25.86,24.42 25.86,25.18 v1(25.61,25.43)
  Bottom Layer w0.254: v1(25.61,25.43) 23.07,25.43 20.17,22.53 20.17,20.75 H13.41
PB10: length 18
  Top Layer w0.254: H14.16 47.52,39.04 45.88,37.4 U1006.69
PB11: length 21.4
  Top Layer w0.254: H14.15 62.89,40.31 48.14,40.31 45.73,37.9 U1006.70
PB12: length 19.6
  Top Layer w0.254: U1006.73 42.91,41.58 H14.14
PB13: length 24.3
  Top Layer w0.254: U1006.74 41.78,41.97 42.07,42.25 60.52,42.25 61.11,42.85 62.89,42.85 H14.13
PB14: length 22.4
  Top Layer w0.254: H14.12 60.26,42.75 41.81,42.75 41.28,42.22 U1006.75
PB15: length 26.6
  Top Layer w0.254: v1(43.08,40.31) 43.08,40.06 42.57,39.55 41.16,39.55 40.78,39.93 U1006.76
  Bottom Layer w0.254: v1(43.08,40.31) 56.04,40.31 58.58,42.85 62.89,42.85 H14.11
PC0: length 18.6
  Top Layer w0.254: H12.20 42.42,4.98 42.73,5.29 42.89,5.29 43.55,5.95 43.55,8.23 42.42,9.36 42.42,10.85 37.28,15.99 U1006.26
PC1: length 15.9
  Top Layer w0.254: U1006.27 37.78,17.04 44.96,9.86 H12.21
PC2: length 19.3
  Top Layer w0.254: U1006.28 38.28,17.05 46.09,9.24 46.09,5.95 45.43,5.29 45.27,5.29 44.96,4.98 H12.22
PC3: length 16.5
  Top Layer w0.254: H12.23 47.5,9.38 38.78,18.1 U1006.29
PC4: length 23
  Top Layer w0.254: H14.38 47.82,24.9 U1006.44
PC5: length 25.8
  Top Layer w0.254: H14.35 62.89,12.37 61.11,12.37 48.08,25.4 U1006.45
PC6: length 35
  Top Layer w0.254: H13.9 4.16,45.39 4.16,41.84 ; 4.16,41.84 4.16,41.58 ; 4.16,41.84 5.3,42.98 20.18,42.98 21.2,44 28.8,44 30.7,42.09 30.7,41.03 U1006.96
PC7: length 32.9
  Top Layer w0.254: v1(30.07,39.55) 30.28,39.76 U1006.97
  Bottom Layer w0.254: 2.89,44.12 4.16,42.85 4.16,41.07 4.93,40.31 15.59,40.31 17.88,38.02 27.02,38.02 28.55,39.55 v1(30.07,39.55)
PC8: length 33.8
  Top Layer w0.254: U1006.98 29.78,41.97 v1(29.31,42.44) ; H13.11 5.94,43.61 v1(17.12,43.61) ; v1(29.56,44.72) 29.31,44.98 v1(20.67,44.98) ; v1(19.15,46.91) 21.34,46.91 v1(21.44,47.01)
  Bottom Layer w0.254: v1(21.44,47.01) 21.44,45.74 v1(20.67,44.98) ; v1(29.56,44.72) 29.56,42.69 v1(29.31,42.44) ; v1(17.12,43.61) 19.15,45.64 v1(19.15,46.91)
PC9: length 31.4
  Top Layer w0.254: v1(28.67,38.82) 29.28,39.43 U1006.99
  Bottom Layer w0.254: 2.89,41.58 4.29,40.19 4.29,38.41 5.05,37.65 16.73,37.65 16.83,37.55 27.4,37.55 v1(28.67,38.82)
PC10: length 17.9
  Top Layer w0.254: U1006.111 20.55,37.9 19.15,36.5 H13.17
PC11: length 21.3
  Top Layer w0.254: 2.89,33.96 4.16,35.23 18.64,35.23 20.81,37.4 U1006.112
PC12: length 18.5
  Top Layer w0.254: H13.19 6.2,34.72 18.89,34.72 21.07,36.9 U1006.113
PC13-TAMPER-RTC: length 16.9
  Top Layer w0.254: H12.6 24.64,4.98 24.95,5.29 25.11,5.29 25.77,5.95 25.77,13.15 27.13,14.52 27.13,16.4 27.78,17.04 U1006.7
PC14-OSC32_IN: length 13.4
  Top Layer w0.254: H12.7 27.18,13.84 28.28,14.94 U1006.8
PC15-OSC32_OUT: length 16.2
  Top Layer w0.254: U1006.9 28.78,15.99 28.63,15.85 28.63,13.47 28.31,13.14 28.31,5.95 27.65,5.29 27.48,5.29 27.18,4.98 H12.8
PD0: length 24.7
  Top Layer w0.254: U1006.114 24,36.4 v1(24.13,36.27)
  Bottom Layer w0.254: 2.89,31.42 4.16,32.69 20.55,32.69 v1(24.13,36.27)
PD1: length 19.2
  Top Layer w0.254: U1006.115 20.83,35.9 19.15,34.21 8.23,34.21 H13.21
PD2: length 25.4
  Top Layer w0.254: U1006.116 24.04,35.4 v1(24.14,35.29)
  Bottom Layer w0.254: v1(24.14,35.29) 19,30.15 4.16,30.15 2.89,28.88
PD3: length 19.8
  Top Layer w0.254: H13.23 10.26,33.71 20.17,33.71 21.36,34.9 U1006.117
PD4: length 26
  Top Layer w0.254: v1(24.16,34.4) U1006.118
  Bottom Layer w0.254: 2.89,26.34 4.16,27.61 17.37,27.61 v1(24.16,34.4)
PD5: length 20.4
  Top Layer w0.254: U1006.119 21.38,33.9 20.67,33.2 12.29,33.2 H13.25
PD6: length 23.4
  Top Layer w0.254: 2.89,23.8 4.16,25.07 5.94,25.07 13.27,32.4 U1006.122
PD7: length 20.7
  Top Layer w0.254: H13.27 13.53,31.9 U1006.123
PD8: length 25.7
  Top Layer w0.254: v1(40.29,39.55) 40.29,40.94 U1006.77
  Bottom Layer w0.254: v1(40.29,39.55) 41.81,41.07 56.04,41.07 H14.10
PD9: length 28.4
  Top Layer w0.254: v1(40.54,42.48) 40.29,42.48 39.78,41.97 U1006.78
  Bottom Layer w0.254: v1(40.54,42.48) 46,47.93 62.89,47.93 H14.9
PD10: length 30.8
  Top Layer w0.254: v1(38.64,39.43) 38.89,39.43 39.28,39.81 U1006.79
  Bottom Layer w0.254: H14.8 45.24,49.2 38.64,42.6 v1(38.64,39.43)
PD11: length 29.5
  Top Layer w0.254: H14.7 62.89,47.93 61.11,47.93 56.54,43.36 40.03,43.36 38.78,42.1 U1006.80
PD12: length 28.6
  Top Layer w0.254: U1006.81 38.28,42.37 39.78,43.87 53.75,43.87 H14.6
PD13: length 32.9
  Top Layer w0.254: H14.5 63.4,51.74 62.13,53.01 53.5,53.01 44.86,44.37 39.53,44.37 37.75,42.6 37.75,40.98 U1006.82
PD14: length 50
  Top Layer w0.254: 3.4,57.33 3.4,56.82 4.67,55.55 30.58,55.55 v1(31.34,54.79) ; 3.4,57.33 2.89,56.82 ; 3.4,57.33 5.4,59.32 U1004.1 ; U1006.85 36.28,50.11 34.14,52.25 34.14,54.03 v1(33.37,54.79)
  Bottom Layer w0.254: v1(31.34,54.79) v1(33.37,54.79)
PD15: length 44.7
  Top Layer w0.254: U1006.86 35.78,41.97 35.15,42.6 v1(34.9,42.6) ; U3.1 3.6,60.12 5.94,60.12 6.2,59.87 6.2,57.58 H13.1 ; v1(31.09,44.63) 30.07,45.64 16.61,45.64 v1(12.55,49.71)
  Bottom Layer w0.254: H13.1 v1(12.55,49.71) ; v1(31.09,44.63) 31.85,44.63 33.88,42.6 v1(34.9,42.6)
PE0: length 32.1
  Top Layer w0.254: U1006.141 21.2,22.9 12.96,14.66 v1(12.96,9.32)
  Bottom Layer w0.254: 2.89,3.48 4.16,2.21 5.85,2.21 v1(12.96,9.32)
PE1: length 28.1
  Top Layer w0.254: U1006.142 24.11,22.4 v1(24.23,22.28)
  Bottom Layer w0.254: H13.43 v1(24.23,22.28)
PE2: length 15.1
  Top Layer w0.254: U1006.1 24.78,18.1 19.56,12.88 H12.1
PE3: length 17.8
  Top Layer w0.254: H12.2 20.97,5.29 20.97,12.74 25.28,17.05 U1006.2
PE4: length 14.5
  Top Layer w0.254: U1006.3 25.78,17.04 22.1,13.36 H12.3
PE5: length 17.3
  Top Layer w0.254: H12.4 22.1,4.98 22.41,5.29 22.57,5.29 23.23,5.95 23.23,13.99 26.13,16.9 26.13,17.95 26.28,18.1 U1006.4
PE6: length 13.8
  Top Layer w0.254: U1006.5 26.78,15.99 24.64,13.85 H12.5
PE7: length 19.6
  Top Layer w0.254: H14.26 56.06,31.9 U1006.58
PE8: length 22.3
  Top Layer w0.254: U1006.59 56.33,32.4 61.11,27.61 62.89,27.61 H14.23
PE9: length 19
  Top Layer w0.254: U1006.60 57.6,32.9 H14.24
PE10: length 18.5
  Top Layer w0.254: U1006.63 58.64,34.4 H14.22
PE11: length 21.3
  Top Layer w0.254: H14.21 62.89,32.69 61.11,32.69 58.91,34.9 U1006.64
PE12: length 17.9
  Top Layer w0.254: U1006.65 60.18,35.4 H14.20
PE13: length 20.6
  Top Layer w0.254: U1006.66 60.45,35.9 61.11,35.23 62.89,35.23 H14.19
PE14: length 17.3
  Top Layer w0.254: U1006.67 61.52,36.4 H14.18
PE15: length 20.7
  Top Layer w0.254: H14.17 62.89,37.77 61.11,37.77 60.25,36.9 U1006.68
PF0: length 13.1
  Top Layer w0.254: U1006.10 29.28,10.73 29.72,10.29 H12.9
PF1: length 16.5
  Top Layer w0.254: U1006.11 29.78,10.74 30.85,9.67 30.85,5.95 30.19,5.29 30.03,5.29 29.72,4.98 H12.10
PF2: length 13.8
  Top Layer w0.254: H12.11 32.26,9.8 30.28,11.78 U1006.12
PF3: length 17.1
  Top Layer w0.254: H12.12 32.26,4.98 32.57,5.29 32.73,5.29 33.39,5.95 33.39,9.18 30.78,11.79 U1006.13
PF4: length 14.4
  Top Layer w0.254: U1006.14 31.28,12.84 34.8,9.32 H12.13
PF5: length 17.8
  Top Layer w0.254: U1006.15 31.78,12.84 35.93,8.69 35.93,5.95 35.27,5.29 35.11,5.29 34.8,4.98 H12.14
PF6: length 14.6
  Top Layer w0.254: U1006.18 33.28,13.89 37.34,9.83 H12.15
PF7: length 18
  Top Layer w0.254: U1006.19 33.78,13.89 38.47,9.2 38.47,5.95 37.81,5.29 37.64,5.29 37.34,4.98 H12.16
PF8: length 15.2
  Top Layer w0.254: U1006.20 34.28,14.94 39.88,9.34 H12.17
PF9: length 18.6
  Top Layer w0.254: U1006.21 34.78,14.94 41.01,8.71 41.01,5.95 40.35,5.29 40.19,5.29 39.88,4.98 H12.18
PF10: length 15.9
  Top Layer w0.254: U1006.22 35.28,15.99 42.42,8.85 H12.19
PF11: length 24.5
  Top Layer w0.254: U1006.49 51.17,27.4 61.11,17.45 62.89,17.45 H14.31
PF12: length 21.1
  Top Layer w0.254: U1006.50 52.44,27.9 H14.32
PF13: length 24.3
  Top Layer w0.254: H14.29 62.89,19.99 61.11,19.99 51.7,29.4 U1006.53
PF14: length 20.9
  Top Layer w0.254: U1006.54 52.98,29.9 H14.30
PF15: length 23.6
  Top Layer w0.254: U1006.55 53.25,30.4 61.11,22.53 62.89,22.53 H14.27
PG0: length 20.2
  Top Layer w0.254: H14.28 54.52,30.9 U1006.56
PG1: length 25
  Top Layer w0.254: v1(42.81,31.4) U1006.57
  Bottom Layer w0.254: v1(42.81,31.4) 46.6,27.61 62.89,27.61 H14.25
PG2: length 50.1
  Top Layer w0.254: v1(18.39,46.28) 23.72,46.28 29.05,51.62 30.58,51.62 33.63,48.57 v1(33.63,44.25) ; v1(35.28,39.55) U1006.87
  Bottom Layer w0.254: v1(35.28,39.55) 35.53,39.81 35.53,42.86 34.14,44.25 v1(33.63,44.25) ; 2.89,54.28 4.04,55.43 5.94,55.43 15.08,46.28 v1(18.39,46.28)
PG3: length 36.7
  Top Layer w0.254: v1(34,39.43) 34.26,39.43 34.77,39.93 34.77,40.94 U1006.88
  Bottom Layer w0.254: v1(34,39.43) 32.48,40.95 18.76,40.95 H13.3
PG4: length 44.2
  Top Layer w0.254: 34.58,48.5 34.28,48.2 U1006.89 ; 34.58,48.5 LED4.4 ; 34.58,48.5 33.88,49.2 33.63,49.2 30.58,52.25 29.05,52.25 25.5,48.69 14.58,48.69 12.8,50.47 4.16,50.47 2.89,51.74
PG5: length 35.7
  Top Layer w0.254: v1(23.47,49.45) 23.21,49.2 17.37,49.2 14.83,51.74 H13.5 ; v1(31.09,45.64) 30.58,46.15 24.99,46.15 v1(24.74,46.41) ; v1(32.86,44.63) 32.86,44.12 33.78,43.21 U1006.90
  Bottom Layer w0.254: v1(24.74,46.41) 23.47,47.68 v1(23.47,49.45) ; v1(32.86,44.63) 31.85,45.64 v1(31.09,45.64)
PG6: length 34.6
  Top Layer w0.254: 2.89,49.2 4.29,47.81 6.06,47.81 9.62,44.25 20.8,44.25 21.05,44.51 28.92,44.51 30.41,43.02 32.23,43.02 33.28,41.97 U1006.91
PG7: length 32.9
  Top Layer w0.254: v1(32.73,39.43) 32.73,40.91 U1006.92
  Bottom Layer w0.254: H13.7 9.75,49.2 18.51,40.44 31.72,40.44 v1(32.73,39.43)
PG8: length 34.6
  Top Layer w0.254: v1(25.37,39.17) 26.38,38.16 30.45,38.16 32.28,39.99 U1006.93
  Bottom Layer w0.254: v1(25.37,39.17) 19.02,39.17 12.8,45.39 4.16,45.39 2.89,46.66
PG9: length 24
  Top Layer w0.254: 2.89,21.26 4.16,22.53 5.94,22.53 14.81,31.4 U1006.124
PG10: length 21.3
  Top Layer w0.254: U1006.125 15.07,30.9 H13.29
PG11: length 24.7
  Top Layer w0.254: U1006.126 16.35,30.4 5.94,19.99 4.16,19.99 2.89,18.72
PG12: length 21.9
  Top Layer w0.254: U1006.127 16.61,29.9 H13.31
PG13: length 25.3
  Top Layer w0.254: 2.89,16.18 4.16,17.45 5.94,17.45 17.89,29.4 U1006.128
PG14: length 22.6
  Top Layer w0.254: U1006.129 18.15,28.9 H13.33
PG15: length 25.5
  Top Layer w0.254: U1006.132 18.43,27.4 5.94,14.91 4.16,14.91 2.89,13.64
STLUSBD+: length 15.3
  Top Layer w0.254: v1(11.82,70.54) 11.57,70.79 10.04,70.79 R82.2 ; U1007.33 21.1,71.67 v1(21.22,71.55)
  Bottom Layer w0.254: v1(11.82,70.54) 12.58,71.3 12.58,71.81 12.84,72.06 16.9,72.06 17.66,72.82 19.95,72.82 v1(21.22,71.55)
STLUSBD-: length 1.8
  Top Layer w0.254: U1007.32 21.6,74.22 R81.2
T_JTCK_SWCLK: length 7.3
  Top Layer w0.254: U1007.15 25.84,66.63 24.6,67.87 U1007.26
T_JTMS_SWDIO: length 1.8
  Top Layer w0.254: U1007.27 24.1,74.06 R79.1
T_RXD: length 27.7
  Top Layer w0.254: v1(16.37,73.17) 17,73.17 v1(18.02,72.16) ; LED7.1 5.32,71.4 v1(6.59,71.4) ; v1(22.34,69.87) 22.34,69.11 25.82,65.63 U1007.13
  Bottom Layer w0.254: v1(16.37,73.17) 15.86,72.67 7.86,72.67 v1(6.59,71.4) ; v1(18.02,72.16) 18.02,71.9 20.31,69.62 22.08,69.62 v1(22.34,69.87)
T_SWDIO_IN: length 2
  Top Layer w0.254: U1007.25 25.9,73.42 R79.2
T_TXD: length 29.5
  Top Layer w0.254: 6.31,72.54 v1(8.35,70.51) ; v1(25.62,63.65) 25.58,63.65 U1007.12 ; v1(20.54,59.84) 14.95,59.84 13.68,61.11 v1(13.68,62.89)
  Bottom Layer w0.254: v1(8.35,70.51) 13.68,65.17 v1(13.68,62.89) ; v1(20.54,59.84) 21.81,61.11 21.81,61.62 22.32,62.12 24.09,62.12 v1(25.62,63.65)
USBRENUMN: length 9.1
  Top Layer w0.254: R19.1 13.71,69.14 15.99,69.14 16.25,69.39 16.25,69.65 17.23,70.63 U1007.38
VREF: length 7.6
  Top Layer w0.254: U1006.32 40.28,20.37 38.58,22.07 v1(38.58,22.32)
  Bottom Layer w0.254: R73.2 38.12,21.87 v1(38.58,22.32) 38.58,24.7 C32.1
$1N11988: length 1.9
  Top Layer w0.254: U3.2 2.79,62.86
$1N11998: length 1.9
  Top Layer w0.254: U1004.2 5.46,62.86
$1N12007: length 2.4
  Top Layer w0.254: R3.1 54.9,61.99 U1.2
$1N12170: length 4.8
  Top Layer w0.254: 35.18,53.2 v1(36.19,53.2)
  Bottom Layer w0.254: v1(36.19,53.2) 38.34,53.2 R76.2 39.77,53.19 C39.1
$1N14474: length 4.3
  Top Layer w0.254: U1007.3 20.6,63.37 20.1,62.86 18.36,62.86 R77.2
$1N14475: length 6.6
  Top Layer w0.254: 20.11,64.13 20.11,64.89 20.05,64.95 19.98,64.95 19.77,65.16 19.35,65.16 16.3,62.1 R1.2
$1N14483: length 2.7
  Top Layer w0.254: U1007.20 26.61,69.14 R26.2
$1N14522: length 2.6
  Top Layer w0.254: Q1.2 9.35,68.31 R16.2
$1N14524: length 8.1
  Top Layer w0.254: Q1.1 9.34,66.41 R19.2 9.41,63.68 R18.2 R17.1
$1N14545: length 4.2
  Top Layer w0.254: R83.2 15.73,70.09 v1(16.24,70.59) ; U1007.39 17.34,70.13 16.83,69.62 v1(16.83,69.37)
  Bottom Layer w0.254: v1(16.83,69.37) 16.24,69.96 v1(16.24,70.59)
$1N14546: length 2.7
  Top Layer w0.254: U1007.44 15.73,67.63 R78.1
$1N14552: length 27
  Top Layer w0.254: 12.94,72.87 v1(11.92,71.86)
  Bottom Layer w0.254: R84.2 21.96,65.17 19.59,67.54 13.96,67.54 11.16,70.33 11.16,71.09 v1(11.92,71.86)
$1N14560: length 43.4
  Top Layer w0.254: v1(9.64,74.06) 9.89,74.32 LED8.2 ; v1(12.69,65.17) v1(15.48,65.17)
  Bottom Layer w0.254: v1(12.69,65.17) 12.43,65.43 11.67,65.43 5.83,71.27 5.83,71.52 8.37,74.06 v1(9.64,74.06) ; 39.41,65.21 38.61,64.41 20.56,64.41 19.29,65.68 15.99,65.68 v1(15.48,65.17)
$1N14561: length 39.2
  Top Layer w0.254: v1(23.99,70.07) 23.23,70.84 v1(23.23,71.34) ; v1(33.64,69.31) v1(37.45,69.31) ; 8.49,74.14 v1(9.26,73.38)
  Bottom Layer w0.254: v1(23.23,71.34) 22.46,71.34 20.05,73.76 12.94,73.76 12.56,73.38 v1(9.26,73.38) ; v1(33.64,69.31) 32.88,70.07 v1(23.99,70.07) ; R11.2 38.55,66.01 39.99,66.01 40.24,66.26 40.24,67.28 38.21,69.31 v1(37.45,69.31)
$1N14562: length 34.6
  Top Layer w0.254: v1(13.19,71.47) 12.94,71.22 8.62,71.22 7.61,72.23 7.61,72.74 6.84,73.5 4.81,73.5 LED7.2 ; v1(19.8,68.17) v1(21.07,66.9)
  Bottom Layer w0.254: v1(21.07,66.9) 22.08,65.88 33.7,65.88 R23.2 ; v1(13.19,71.47) 16.5,71.47 v1(19.8,68.17)
$1N14563: length 36.3
  Top Layer w0.254: LED5.2 6.57,74.24 v1(7.33,75)
  Bottom Layer w0.254: v1(7.33,75) 8.07,75.74 19.03,75.74 22.82,71.95 31.97,71.95 35.27,68.65 35.27,65.96 R24.2
$1N18116: length 6.9
  Top Layer w0.254: R86.2 43.67,68.51 47.36,68.51 48.22,67.65 USB4.4

## Copper pours and planes (outline as drawn; the poured copper is in the pictures)
GND on Top Layer: -6.86,83.49 76.58,83.49 76.58,-0.2 -6.86,-0.2
GND on Bottom Layer: -8,82.73 77.47,82.73 77.47,-4.78 -8,-4.78

## Text on the board
Bottom Silkscreen Layer: S.F103.Z6-STL "SS" | ⚡ | Prototype 01
Top Silkscreen Layer: 3.3'SWIO'SWLCK'G | BOOT | NRST | WKUP
